# Altium schematic sheet TELEMETRY_SCH.SchDoc
size A
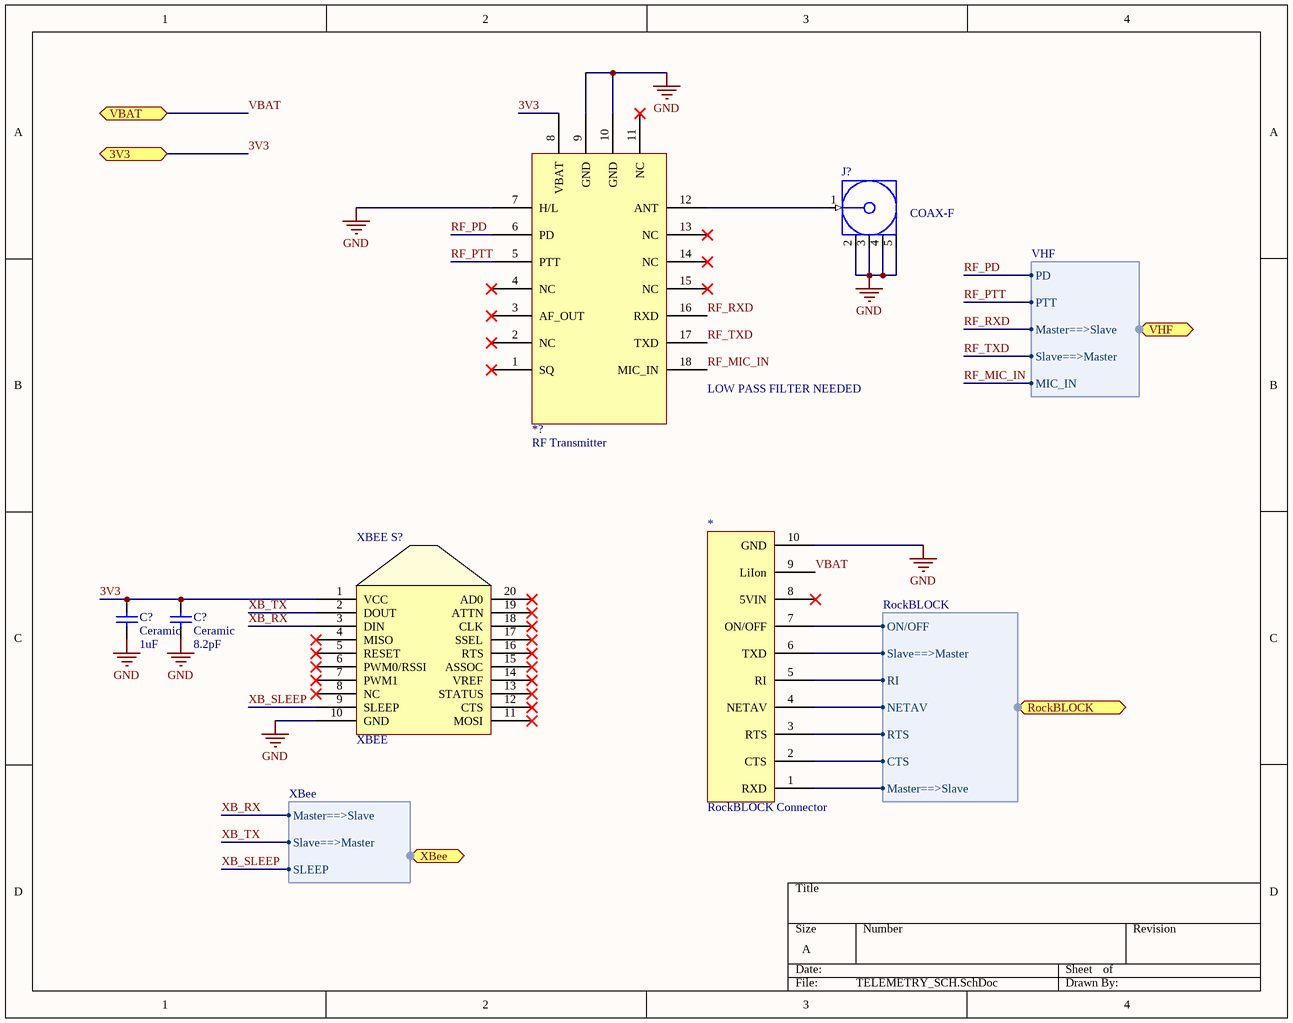
[diagram p0: TELEMETRY_SCH.SchDoc]

## Parts
(Parts that share a designator on the sheet are numbered #1, #2 ... from top to bottom, then left to right.)
*  RockBLOCK Connector
*?  RF Transmitter
C?#1  Ceramic  value 1uF  [RAD-0.3]
C?#2  Ceramic  value 8.2pF  [RAD-0.3]
J?  COAX-F  [MCX5.08-H5]
XBEE_S?  XBEE

## Ports
3V3, RockBLOCK (harness RockBLOCK), VBAT, VHF (harness VHF), XBee (harness XBee)

## Harnesses
RockBLOCK: ON/OFF, Slave==>Master, RI, NETAV, RTS, CTS, Master==>Slave
VHF: PD, PTT, Master==>Slave, Slave==>Master, MIC_IN
XBee: Master==>Slave, Slave==>Master, SLEEP

## Nets
GND: *.10(GND) *?.7(H/L) *?.9(GND) *?.10(GND) C?#1.1 C?#2.1 J?.2(GND) J?.3(GND) J?.4(GND) J?.5(GND) XBEE_S?.10(GND)
3V3: *?.8(VBAT) C?#1.2 C?#2.2 XBEE_S?.1(VCC) ; port 3V3
RF_MIC_IN: *?.18(MIC_IN) ; port VHF.MIC_IN
RF_PD: *?.6(PD) ; port VHF.PD
RF_PTT: *?.5(PTT) ; port VHF.PTT
RF_RXD: *?.16(RXD) ; port VHF.Master==>Slave
RF_TXD: *?.17(TXD) ; port VHF.Slave==>Master
VBAT: *.9(LiIon) ; port VBAT
XB_RX: XBEE_S?.3(DIN) ; port XBee.Master==>Slave
XB_SLEEP: XBEE_S?.9(SLEEP) ; port XBee.SLEEP
XB_TX: XBEE_S?.2(DOUT) ; port XBee.Slave==>Master
Net*?_12: *?.12(ANT) J?.1(Signal)
Net*_1: *.1(RXD) ; port RockBLOCK.Master==>Slave
Net*_2: *.2(CTS) ; port RockBLOCK.CTS
Net*_3: *.3(RTS) ; port RockBLOCK.RTS
Net*_4: *.4(NETAV) ; port RockBLOCK.NETAV
Net*_5: *.5(RI) ; port RockBLOCK.RI
Net*_6: *.6(TXD) ; port RockBLOCK.Slave==>Master
Net*_7: *.7(ON/OFF) ; port RockBLOCK.ON/OFF

Not connected (* = marked no-connect by the designer): * 8(5VIN)*; *? 1(SQ)* 2(NC)* 3(AF_OUT)* 4(NC)* 11(NC)* 13(NC)* 14(NC)* 15(NC)*; XBEE_S? 4(MISO)* 5(RESET)* 6(PWM0/RSSI)* 7(PWM1)* 8(NC)* 11(MOSI)* 12(CTS)* 13(STATUS)* 14(VREF)* 15(ASSOC)* 16(RTS)* 17(SSEL)* 18(CLK)* 19(ATTN)* 20(AD0)*

## Notes on the sheet
- (near *?) LOW PASS FILTER NEEDED

## Library data of the parts
*? = RF Transmitter: DRA818V
C?#1 C?#2 = Cap: Capacitor; Published: 8-Jun-2000; LatestRevisionDate: 17-Jul-2002; LatestRevisionNote: Re-released for DXP Platform.; PackageReference: RAD-0.3; Publisher: Altium Limited; PackageDescription: Radial Cap, Thru-Hole; 2 Leads; 0.3 in Pin Spacing
J? = COAX-F: RF Coaxial PCB Connector, MCX; Thru-Hole, Right-Angle Mount Socket, Blunt Post Terminal, 50 Ohm Impedance; PCB_Layout: Complies with manufacturer's recommendation.; DrillSize: Corresponds to nominal value.; Published: 15-Jul-2004; LatestRevisionDate: 15-Jul-2004; LatestRevisionNote: Component Replaced.; DatasheetDocument: 30-May-2003; PackageDocument: 04-Jul-1999; PackageReference: 919-119J-51AX; Publisher: Altium Limited; ComponentLink1Description: Manufacturer Link; ComponentLink1URL: http://www.amphenolrf.com/
XBEE_S? = XBEE: XB24CZ7WIT-004